# Altium schematic sheet Block-Diagram.SchDoc: Block Diagram
size 279 x 215 mm; DrawnBy: Ethan Abraham; Engineer: Ethan Abraham; Revision: 1.0; SheetNumber: 1; SheetTotal: 7
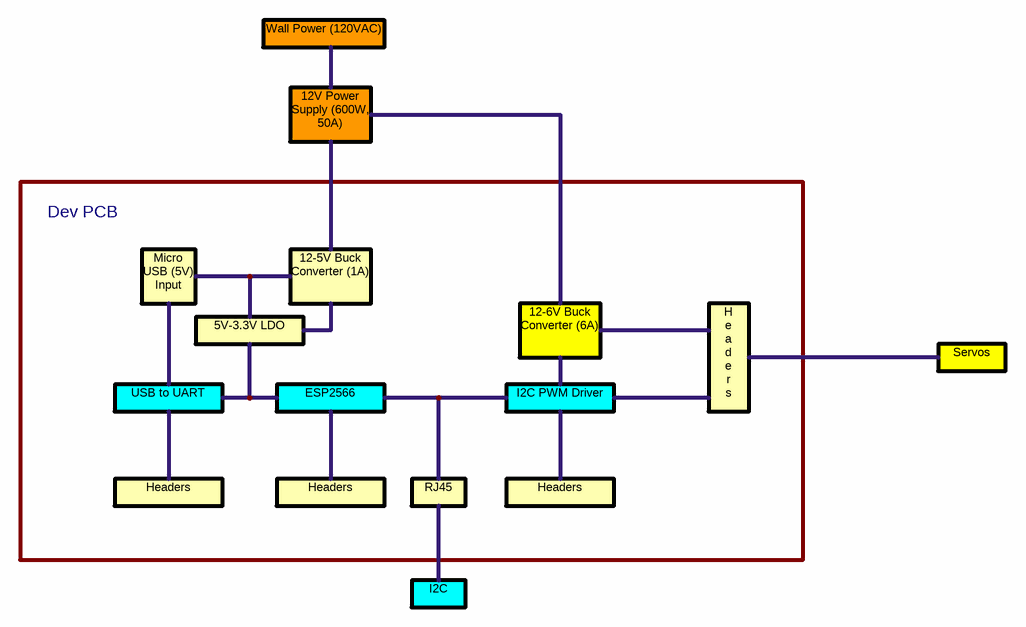
[diagram p0: Block-Diagram.SchDoc]

## Notes on the sheet
- Wall Power (120VAC)
- 12V Power Supply (600W, 50A)
- Dev PCB
- Micro USB (5V) Input
- 12-5V Buck Converter (1A)
- 5V-3.3V LDO
- 12-6V Buck Converter (6A)
- Servos
- USB to UART
- ESP2566
- I2C PWM Driver
- H
  e
  a
  d
  e
  r
  s
- Headers
- RJ45
- I2C
- PuttPilot
- 200 University Ave W
- PROJECT
- Waterloo, Ontario, Canada
- N2L 3G1
- REVISION
- DOCUMENT
- ENGINEER
- REVIEWER
- MODIFIED
- SHEET
- OF